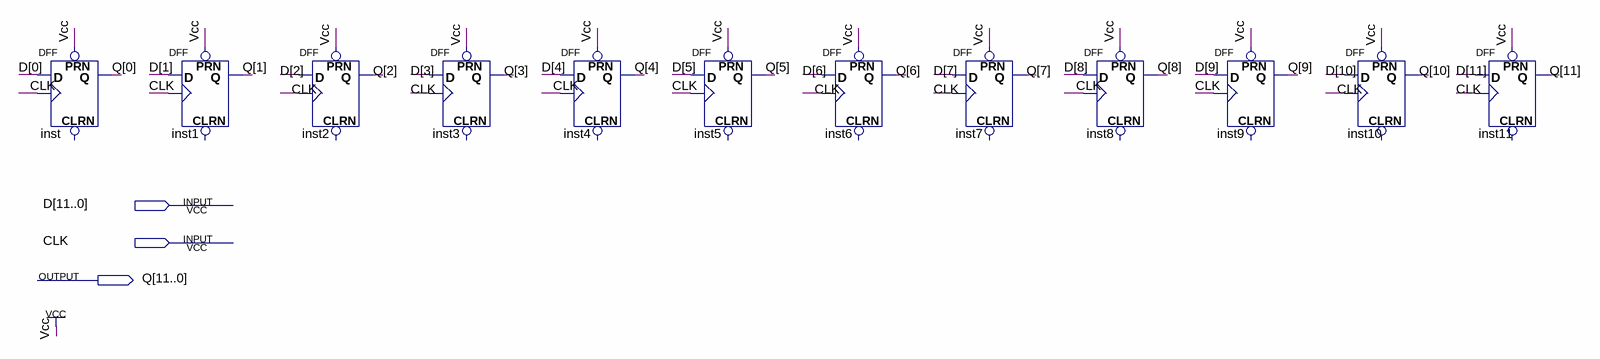
[diagram p0: schematic sheet]
// Quartus schematic registro12bits.bdf as structural Verilog: 12 symbols, 3 pins
module registro12bits (
  input  [11:0] D,
  input  CLK,
  output [11:0] Q
);

  DFF inst (.CLK(CLK), .D(D[0]), .PRN(1'b1), .Q(Q[0]));  // open: CLRN
  DFF inst1 (.CLK(CLK), .D(D[1]), .PRN(1'b1), .Q(Q[1]));  // open: CLRN
  DFF inst2 (.CLK(CLK), .D(D[2]), .PRN(1'b1), .Q(Q[2]));  // open: CLRN
  DFF inst3 (.CLK(CLK), .D(D[3]), .PRN(1'b1), .Q(Q[3]));  // open: CLRN
  DFF inst4 (.CLK(CLK), .D(D[4]), .PRN(1'b1), .Q(Q[4]));  // open: CLRN
  DFF inst5 (.CLK(CLK), .D(D[5]), .PRN(1'b1), .Q(Q[5]));  // open: CLRN
  DFF inst6 (.CLK(CLK), .D(D[6]), .PRN(1'b1), .Q(Q[6]));  // open: CLRN
  DFF inst7 (.CLK(CLK), .D(D[7]), .PRN(1'b1), .Q(Q[7]));  // open: CLRN
  DFF inst8 (.CLK(CLK), .D(D[8]), .PRN(1'b1), .Q(Q[8]));  // open: CLRN
  DFF inst9 (.CLK(CLK), .D(D[9]), .PRN(1'b1), .Q(Q[9]));  // open: CLRN
  DFF inst10 (.CLK(CLK), .D(D[10]), .PRN(1'b1), .Q(Q[10]));  // open: CLRN
  DFF inst11 (.CLK(CLK), .D(D[11]), .PRN(1'b1), .Q(Q[11]));  // open: CLRN
endmodule
